# Altium project PPU.PrjPcb
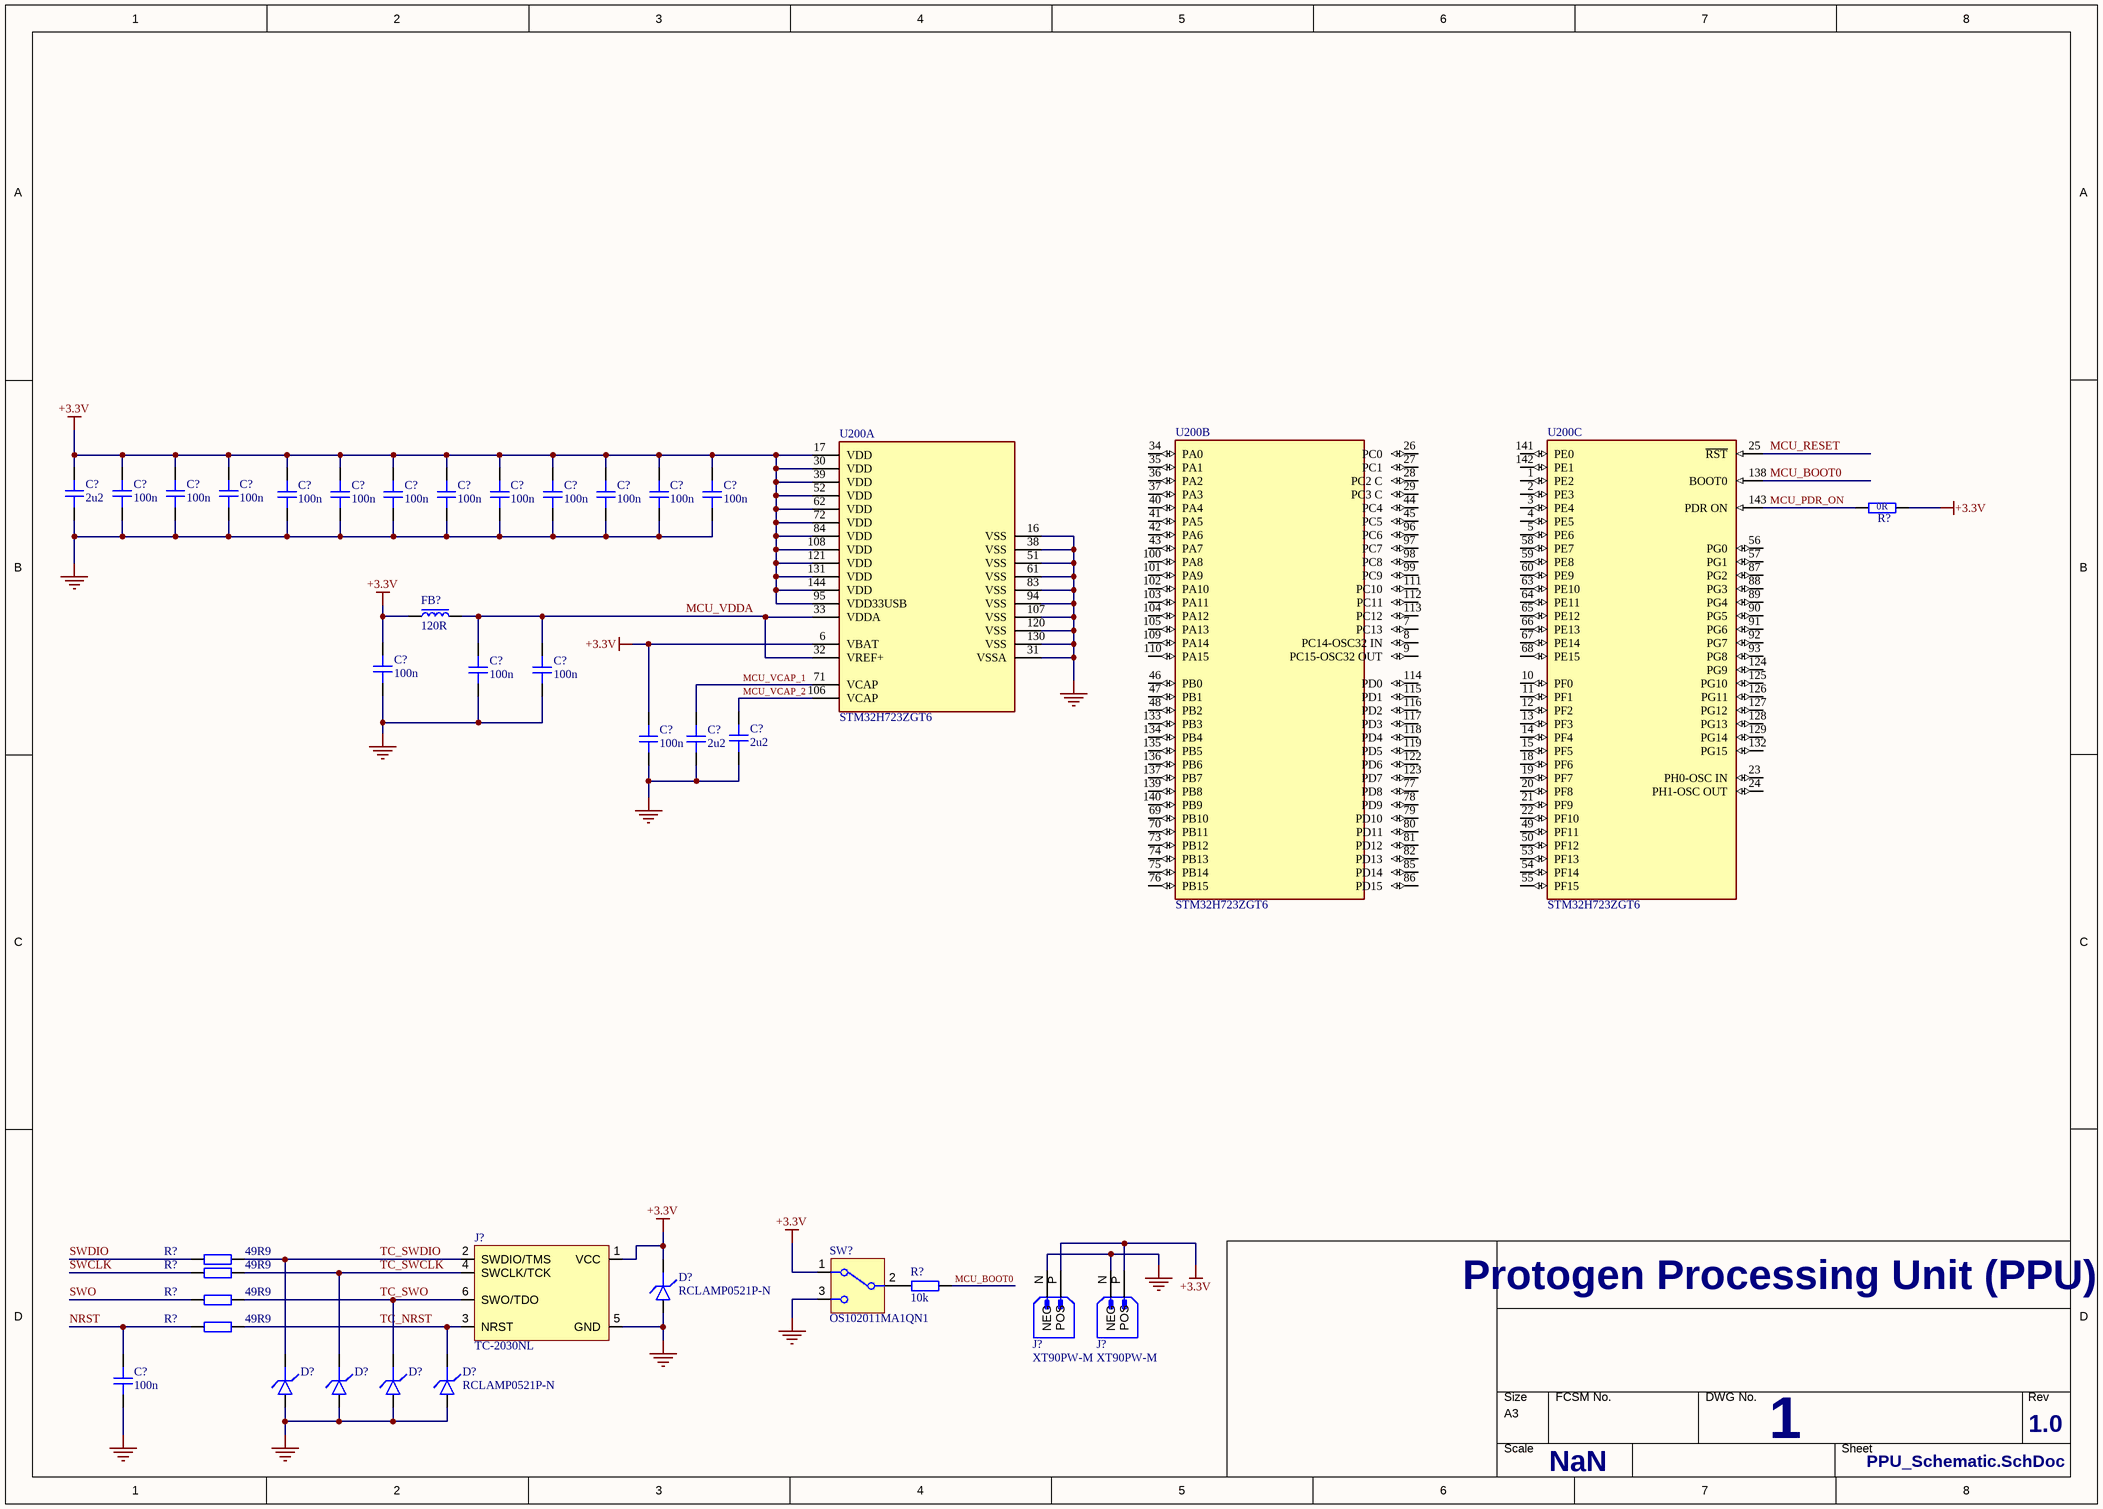
[diagram p0: PPU_Schematic.SchDoc]
1 sheet, 37 parts. Net scope: global (net labels, ports and power ports of the same name join across sheets).
Board file: PPU_PCB.PcbDoc

## Sheet PPU_Schematic.SchDoc: Protogen Processing Unit (PPU)
size A3; Date: 06/12/2022; ApprovedBy: DeltaWave0x; CheckedBy: DeltaWave0x; Author: DeltaWave0x; DrawnBy: DeltaWave0x; Engineer: DeltaWave0x; DocumentNumber: 1; Revision: 1.0; SheetNumber: 1; SheetTotal: 1

### Parts
(Parts that share a designator on the sheet are numbered #1, #2 ... from top to bottom, then left to right.)
C?#1  2u2  [CAP_0603]
C?#2  100n  [CAP_0402]
C?#3  100n  [CAP_0402]
C?#4  100n  [CAP_0402]
C?#5  100n  [CAP_0402]
C?#6  100n  [CAP_0402]
C?#7  100n  [CAP_0402]
C?#8  100n  [CAP_0402]
C?#9  100n  [CAP_0402]
C?#10  100n  [CAP_0402]
C?#11  100n  [CAP_0402]
C?#12  100n  [CAP_0402]
C?#13  100n  [CAP_0402]
C?#14  100n  [CAP_0402]
C?#15  100n  [CAP_0402]
C?#16  100n  [CAP_0402]
C?#17  100n  [CAP_0402]
C?#18  2u2  [CAP_0603]
C?#19  2u2  [CAP_0603]
C?#20  100n  [CAP_0402]
D?#1  RCLAMP0521P-N  [D_0402]
D?#2  RCLAMP0521P-N  [D_0402]  (value not drawn)
D?#3  RCLAMP0521P-N  [D_0402]  (value not drawn)
D?#4  RCLAMP0521P-N  [D_0402]  (value not drawn)
D?#5  RCLAMP0521P-N  [D_0402]
FB?  120R  [FB_0603]
J?#1  XT90PW-M  [AMASS_XT90PW-M]
J?#2  XT90PW-M  [AMASS_XT90PW-M]
J?#3  TC-2030NL  [TC2030-NL-FP]
R?#1  0R  [RES_0402]
R?#2  49R9  [RES_0402]
R?#3  49R9  [RES_0402]
R?#4  10k  [RES_0402]
R?#5  49R9  [RES_0402]
R?#6  49R9  [RES_0402]
SW?  OS102011MA1QN1  [OS102011MA1QN1]
U200  STM32H723ZGT6  [FP-LQFP144-1A-IPC_A]  (parts A,B,C of 3)

### Nets
+3.3V: C?#1.2 C?#2.2 C?#3.2 C?#4.2 C?#5.2 C?#6.2 C?#7.2 C?#8.2 C?#9.2 C?#10.2 C?#11.2 C?#12.2 C?#13.2 C?#14.2 C?#17.2 D?#1.K FB?.1 J?#1.P(POS) J?#2.P(POS) J?#3.1(VCC) R?#1.2 SW?.1 U200.6(VBAT) U200.17(VDD) U200.30(VDD) U200.39(VDD) U200.52(VDD) U200.62(VDD) U200.72(VDD) U200.84(VDD) U200.95(VDD33USB) U200.108(VDD) U200.121(VDD) U200.131(VDD) U200.144(VDD)
GND: C?#1.1 C?#2.1 C?#3.1 C?#4.1 C?#5.1 C?#6.1 C?#7.1 C?#8.1 C?#9.1 C?#10.1 C?#11.1 C?#12.1 C?#13.1 C?#14.1 C?#15.1 C?#16.1 C?#17.1 C?#18.1 C?#19.1 C?#20.1 D?#1.A D?#2.A D?#3.A D?#4.A D?#5.A J?#1.N(NEG) J?#2.N(NEG) J?#3.5(GND) SW?.3 U200.16(VSS) U200.31(VSSA) U200.38(VSS) U200.51(VSS) U200.61(VSS) U200.83(VSS) U200.94(VSS) U200.107(VSS) U200.120(VSS) U200.130(VSS)
MCU_BOOT0: R?#4.2 U200.138(BOOT0)
MCU_PDR_ON: R?#1.1 U200.143(PDR_ON)
MCU_RESET: U200.25(~{RST})
MCU_VCAP_1: C?#18.2 U200.71(VCAP)
MCU_VCAP_2: C?#19.2 U200.106(VCAP)
MCU_VDDA: C?#15.2 C?#16.2 FB?.2 U200.32(VREF+) U200.33(VDDA)
NRST: C?#20.2 R?#6.1
SWCLK: R?#3.1
SWDIO: R?#2.1
SWO: R?#5.1
TC_NRST: D?#5.K J?#3.3(NRST) R?#6.2
TC_SWCLK: D?#3.K J?#3.4(SWCLK/TCK) R?#3.2
TC_SWDIO: D?#2.K J?#3.2(SWDIO/TMS) R?#2.2
TC_SWO: D?#4.K J?#3.6(SWO/TDO) R?#5.2
NetR?#4_1: R?#4.1 SW?.2(COM)

Not connected (* = marked no-connect by the designer): U200 1(PE2) 2(PE3) 3(PE4) 4(PE5) 5(PE6) 7(PC13) 8(PC14-OSC32_IN) 9(PC15-OSC32_OUT) 10(PF0) 11(PF1) 12(PF2) 13(PF3) 14(PF4) 15(PF5) 18(PF6) 19(PF7) 20(PF8) 21(PF9) 22(PF10) 23(PH0-OSC_IN) 24(PH1-OSC_OUT) 26(PC0) 27(PC1) 28(PC2_C) 29(PC3_C) 34(PA0) 35(PA1) 36(PA2) 37(PA3) 40(PA4) 41(PA5) 42(PA6) 43(PA7) 44(PC4) 45(PC5) 46(PB0) 47(PB1) 48(PB2) 49(PF11) 50(PF12) 53(PF13) 54(PF14) 55(PF15) 56(PG0) 57(PG1) 58(PE7) 59(PE8) 60(PE9) 63(PE10) 64(PE11) 65(PE12) 66(PE13) 67(PE14) 68(PE15) 69(PB10) 70(PB11) 73(PB12) 74(PB13) 75(PB14) 76(PB15) 77(PD8) 78(PD9) 79(PD10) 80(PD11) 81(PD12) 82(PD13) 85(PD14) 86(PD15) 87(PG2) 88(PG3) 89(PG4) 90(PG5) 91(PG6) 92(PG7) 93(PG8) 96(PC6) 97(PC7) 98(PC8) 99(PC9) 100(PA8) 101(PA9) 102(PA10) 103(PA11) 104(PA12) 105(PA13) 109(PA14) 110(PA15) 111(PC10) 112(PC11) 113(PC12) 114(PD0) 115(PD1) 116(PD2) 117(PD3) 118(PD4) 119(PD5) 122(PD6) 123(PD7) 124(PG9) 125(PG10) 126(PG11) 127(PG12) 128(PG13) 129(PG14) 132(PG15) 133(PB3) 134(PB4) 135(PB5) 136(PB6) 137(PB7) 139(PB8) 140(PB9) 141(PE0) 142(PE1)

### Notes on the sheet
- NaN
- THIS DOCUMENT AND THE DATA DISCLOSED HEREIN OR
- HEREWITH IS THE PROPERTY OF ALTIUM LIMITED AND MAY
- DWG NO:
- REVISION
- REV:
- DESCRIPTION
- DATE
- APPROVED
- BE FREELY DISTRIBUTED IN WHOLE. NO RIGHTS ARE
- RESERVED OR EXPRESS OR IMPLIED WARANTEE GIVEN.
- ENG:
- APPROVALS
- PROJECT
- DSN:
- CHK:
- REFERENCE DOCUMENTS
- PROJECT REVISION:
- TITLE
- DOCUMENT REVISION:
- DESIGN ITEM:
- BOM:
- FAB DWG:
- PCB DWG:
- ASSY DWG:
- SCALE:
- A3
- SIZE
- CAGE CODE
- FILE NAME
- DWG NO.
- SHEET
- OF
- REV

### Library data of the parts
C?#1 C?#18 C?#19 = CAP_0603_16V: Capacitor SMD 0603 16V
C?#2-C?#17 C?#20 = CAP_0402_16V: Capacitor SMD 0402 16V
D?#1-D?#5 = D_TVS_0402: Diode TVS / ESD 0402
FB? = FB_0603: Ferrite Bead SMD 0603
J?#1 J?#2 = XT90PW-M: Socket; DC supply; XT90; male; PIN: 2; on PCBs; THT; Colour: yellow; MF: AMASS; MP: XT90PW-M; Package: Package; Availability: Not in stock; Value: *; Price: None; Check_prices: https://www.snapeda.com/parts/XT90PW-M/AMASS/view-part/?ref=eda; SnapEDA_Link: https://www.snapeda.com/parts/XT90PW-M/AMASS/view-part/?ref=snap
J?#3 = TC2030-NL: Tag-Connect No-Solder SWD Debug Connector (No Legs) DO NOT PLACE; Manufacturer: Tag-Connect; Manfucaturer Number: TC2030-NL-FP
R?#1-R?#6 = RES_0402: Resistor SMD 0402
SW? = OS102011MA1QN1: Slide Switch SPDT Horizontal THT; Manufacturer: C&K; Manufacturer Part Number: OS102011MA1QN1
U200 = CMP-12105-000148-1: IC MCU 32BIT 1MB FLASH 144LQFP